# EAGLE design BlueCubeModR2 (EAGLE 9.3.0)

## Sheet 1 of 2
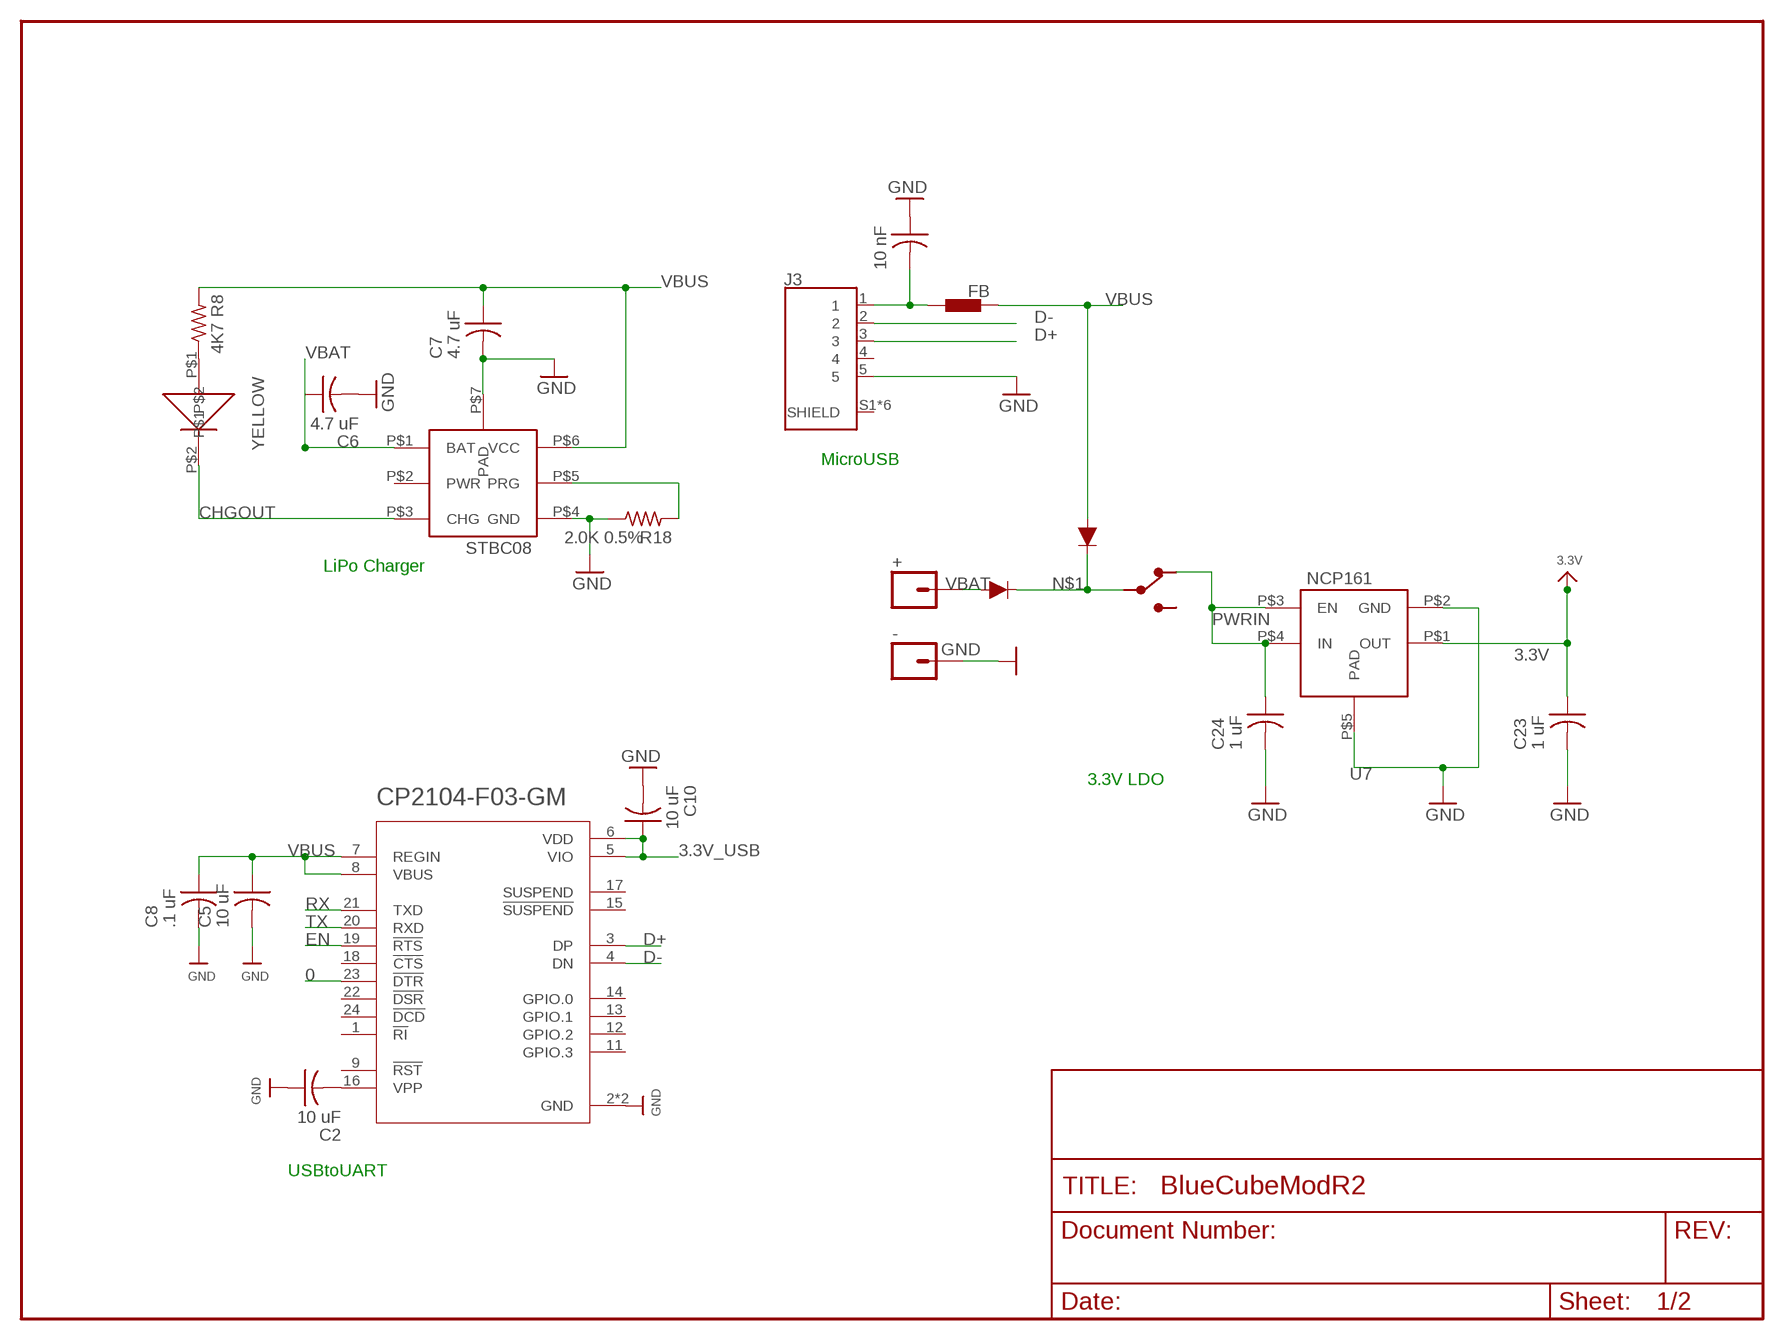
[diagram p0: schematic, sheet 1]

### Parts
+  CONN_01  [1X01]
-  CONN_01  [1X01]
C2  10 uF  C-US  [C0402_B]
C5  10 uF  C-US  [C0402_B]
C6  4.7 uF  C-US  [C0402_B]
C7  4.7 uF  C-US  [C0402_B]
C8  .1 uF  C-US  [C0402_B]
C10  10 uF  C-US  [C0402_B]
C11  10 nF  C-US  [C0402_B]
C23  1 uF  C-US  [C0402_B]
C24  1 uF  C-US  [C0402_B]
J3  2174507-2  [J_SMD_2174507-2-5_7.8_5_2.71]
L1  FB  BLM15H  [0402]
R8  4K7  R-US_  [R0402_B]
R18  2.0K 0.5%  R-US_  [R0402_B]
S2  JS102011JCQN  [SW_JS102011JCQN]
U2  CP2104-F03-GM  [QFN50P400X400X80-25N]
U4  STBC08  [STBC08]
U7  NCP161  [NCP161]
U$4  DIODD3  [DIODFN100X60X30-2]
U$5  DIODD3  [DIODFN100X60X30-2]
YELLOW  _  0402LED  [0402LED]

### Nets
0: U2.23(!DTR) ; also sheet 2
3.3V: C23.1 U7.P$1(OUT) ; also sheet 2
3.3V_USB: C10.1 U2.5(VIO) U2.6(VDD)
CHGOUT: U4.P$3(CHG) YELLOW.P$2
D+: J3.3 U2.3(DP)
D-: J3.2 U2.4(DN)
EN: U2.19(!RTS) ; also sheet 2
GND: -.1 C2.1 C5.2 C6.2 C7.2 C8.2 C10.2 C11.1 C23.2 C24.2 J3.5 R18.1 U2.2(GND) U2.25(GND) U4.P$4(GND) U4.P$7(PAD) U7.P$2(GND) U7.P$5(PAD) ; also sheet 2
N$1: S2.2 U$4.2(C) U$5.2(C)
N$3: R8.1 YELLOW.P$1
N$5: C11.2 J3.1 L1.2
N$6: C2.2 U2.16(VPP)
N$27: R18.2 U4.P$5(PRG)
PWRIN: C24.1 S2.1 U7.P$3(EN) U7.P$4(IN)
RX: U2.21(TXD) ; also sheet 2
TX: U2.20(RXD) ; also sheet 2
VBAT: +.1 C6.1 U4.P$1(BAT) U$4.1(A)
VBUS: C5.1 C7.1 C8.1 L1.1 R8.2 U2.7(REGIN) U2.8(VBUS) U4.P$6(VCC) U$5.1(A)
Unconnected: J3.4 J3.S1(SHIELD) J3.S2(SHIELD) J3.S3(SHIELD) J3.S4(SHIELD) J3.S5(SHIELD) J3.S6(SHIELD) S2.3 U2.1(!RI) U2.9(!RST!) U2.11(GPIO.3) U2.12(GPIO.2) U2.13(GPIO.1) U2.14(GPIO.0) U2.15(!SUSPEND!) U2.17(SUSPEND) U2.18(!CTS) U2.22(!DSR) U2.24(!DCD) U4.P$2(PWR)

### Notes on the sheet
- MicroUSB
- LiPo Charger
- 3.3V LDO
- USBtoUART

## Sheet 2 of 2
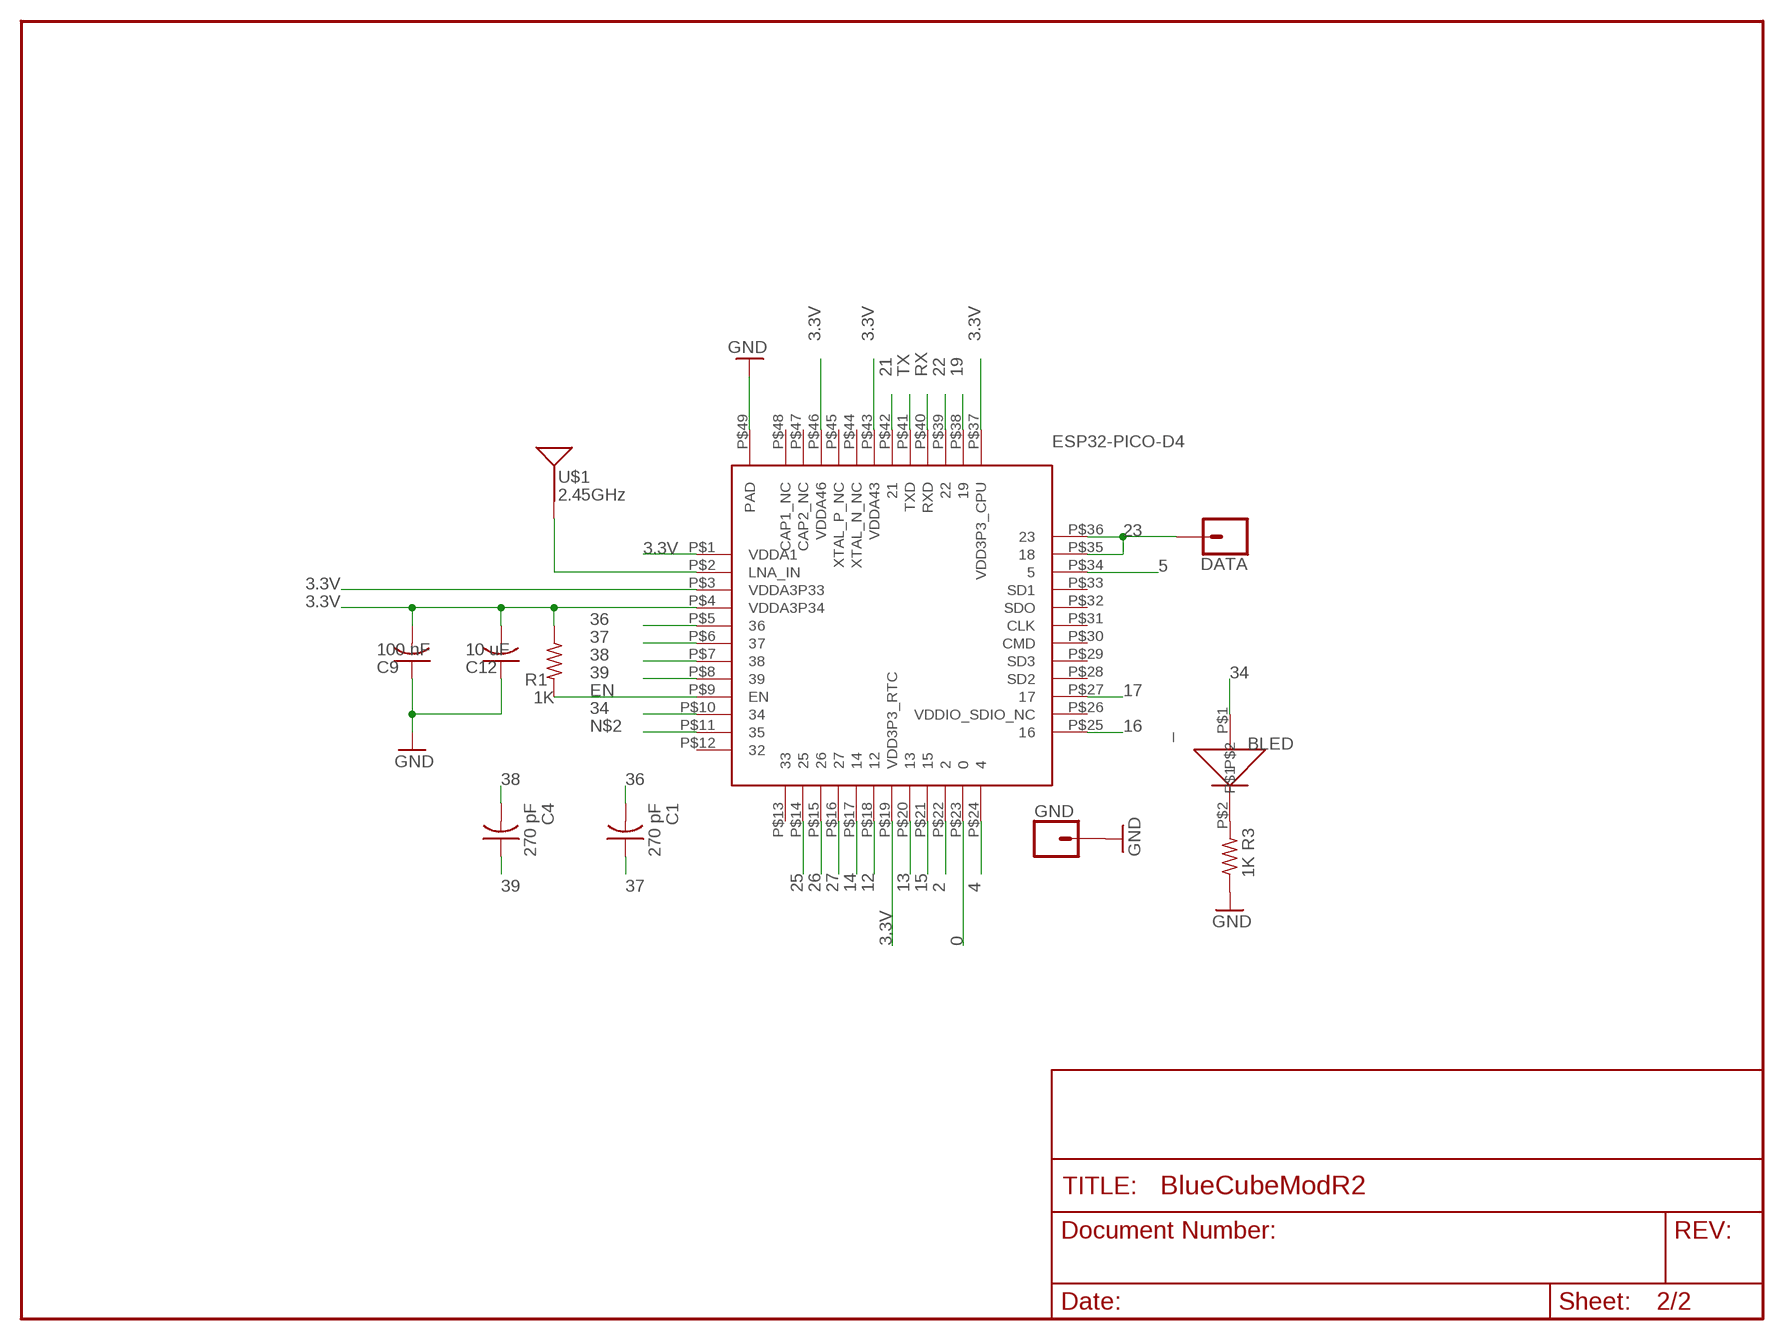
[diagram p1: schematic, sheet 2]

### Parts
BLED  _  0402LED  [0402LED]
C1  270 pF  C-US  [C0402_B]
C4  270 pF  C-US  [C0402_B]
C9  100 nF  C-US  [C0402_B]
C12  10 uF  C-US  [C0402_B]
DATA  CONN_01  [1X01]
GND  CONN_01  [1X01]
R1  1K  R-US_  [R0402_B]
R3  1K  R-US_  [R0402_B]
U1  ESP32-PICO-D4  [ESP32-PICO-D4]
U$1  2.45GHz  ANTENNA2.4GHZ-6.5X2.2MM  [ANT-2.4GHZ-6.5X2.2MM]

### Nets
0: U1.P$23 ; also sheet 1
2: U1.P$22
3.3V: C9.2 C12.2 R1.1 U1.P$1(VDDA1) U1.P$3(VDDA3P33) U1.P$4(VDDA3P34) U1.P$19(VDD3P3_RTC) U1.P$37(VDD3P3_CPU) U1.P$43(VDDA43) U1.P$46(VDDA46) ; also sheet 1
4: U1.P$24
5: U1.P$34
12: U1.P$18
13: U1.P$20
14: U1.P$17
15: U1.P$21
16: U1.P$25
17: U1.P$27
19: U1.P$38
21: U1.P$42
22: U1.P$39
23: DATA.1 U1.P$35 U1.P$36
25: U1.P$14
26: U1.P$15
27: U1.P$16
34: BLED.P$1 U1.P$10
36: C1.2 U1.P$5
37: C1.1 U1.P$6
38: C4.2 U1.P$7
39: C4.1 U1.P$8
EN: R1.2 U1.P$9(EN) ; also sheet 1
ESPANT: U1.P$2(LNA_IN) U$1.FEED(SIGNAL)
GND: C9.1 C12.1 GND.1 R3.1 U1.P$49(PAD) ; also sheet 1
N$2: U1.P$11
N$4: BLED.P$2 R3.2
RX: U1.P$40(RXD) ; also sheet 1
TX: U1.P$41(TXD) ; also sheet 1
Unconnected: U1.P$12 U1.P$13 U1.P$26(VDDIO_SDIO_NC) U1.P$28(SD2) U1.P$29(SD3) U1.P$30(CMD) U1.P$31(CLK) U1.P$32(SDO) U1.P$33(SD1) U1.P$44(XTAL_N_NC) U1.P$45(XTAL_P_NC) U1.P$47(CAP2_NC) U1.P$48(CAP1_NC)

## Library data of the parts
+ - DATA GND = SparkFun-Connectors:CONN_01: Single connection point. Often used as Generic Header-pin footprint for 0.1 inch spaced/style header connections On any of the 0.1 inch spaced packages, you can populate with these: Break Away Headers - Straight <https://www.sparkfun.com/products/116> (PRT-00116) Break Away Male Headers - Right Angle <https://www.sparkfun.com/products/553> (PRT-00553) Female Headers <https://www.sparkfun.com/products/115> (PRT-00115) Break Away Headers - Machine Pin <https://www.sparkfun.com/products/117> (PRT-00117) Break Away Female Headers - Swiss Machine Pin <https://www.sparkfun.com/products/743> (PRT-00743) This device is also useful as a general connection point to wire up your design to another part of your project. Our various solder wires solder well into these plated through hole pads. Hook-Up Wire - Assortment (Stranded, 22 AWG) <https://www.sparkfun.com/products/11375> (PRT-11375) Hook-Up Wire - Assortment (Solid Core, 22 AWG) <https://www.sparkfun.com/products/11367> (PRT-11367) View the entire wire category on our website here <https://www.sparkfun.com/categories/141> Special notes: SMTSO-256-ET is a "flush mount" nut for a 4-40 screw. We mostly use this on specialty testbeds; it is a nice way to connect hardware to your PCB at an adjustable hieght. Also note, the SNAP packages are for using a snappable style connector. We sell a baggie of snaps and they are also used on two LilyPad designs: Snap Assortment - 30 pack (male and female) <https://www.sparkfun.com/products/11347> (DEV-11347) LilyPad Arduino SimpleSnap <https://www.sparkfun.com/products/10941> (DEV-10941) LilyPad SimpleSnap Protoboard <https://www.sparkfun.com/products/10940> (DEV-10940)
BLED YELLOW = Kris:0402LED: 0402led
C1 C2 C4-C12 C23 C24 = Spark:C-US: Capacitor
J3 = 2174507-2:2174507-2: USB - micro B USB 2.0 Receptacle Connector 5 Position Surface Mount, Right Angle; CENTERLINE_PITCH: .65 mm[.025 in]; COMMENT: 2174507\-2; DESCRIPTION: REC TYPE-B ASSY MICRO USB I/O; DIGI-KEY_PART_NUMBER: A118106CT-ND; DIGI-KEY_PURCHASE_URL: https://www.digikey.com/product-detail/en/te-connectivity-amp-connectors/2174507-2/A118106CT-ND/4729913?utm_source=snapeda&utm_medium=aggregator&utm_campaign=symbol; EU_ROHS_COMPLIANCE: Compliant; LINK: http://www.te.com/usa-en/product-2174507-2.html; MF: TE Connectivity; MP: 2174507-2; NUMBER_OF_POSITIONS: 5; PACKAGE: None; PRODUCT_TYPE: Connector
L1 = STM32L433SARA.AssetTracker.v01:BLM15H: EMIFIL (R) Chip Ferrite Bead for GHz Noise Source: http://www.murata.com/ Ferrite Bead BLM15H.pdf
R1 R3 R8 R18 = Spark:R-US_: 0402 Resistor
S2 = JS102011JCQN:JS102011JCQN: Switch Slide Spdt 300ma 6v; AVAILABILITY: Unavailable; DESCRIPTION: Switch Slide Spdt 300ma 6v; MF: C&K; MP: JS102011JCQN; PACKAGE: None; PRICE: None
U1 = Kris:ESP32-PICO-D4: ESP32-PICO-D4 module https://www.espressif.com/sites/default/files/documentation/esp32-pico-d4_datasheet_en.pdf
U2 = CP2104:CP2104: Silabs CP2104 USB to UART Bridge; AVAILABILITY: Unavailable; DESCRIPTION: USB to UART Bridge; MF: Silicon Labs; MP: CP2104; PACKAGE: QFN-24 Silicon Labs; PRICE: None
U4 = Kris:STBC08: STBC08 800 mA standalone LiPo battery charger
U7 = Kris:NCP161: NCP161 3V3 LDO voltage regulator
U$1 = SparkFun-RF:ANTENNA: Single-ended Antennae 2.4GHz and antennae with just one terminal. These are all chip antennae. 2.4GHz (WiFi/BT/ZigBee) Antennae ANT-2.4GHZ-6.5X2.2MM - 6.5 x 2.2 mm chip antenna. (SparkFun Product <https://www.sparkfun.com/products/144>) ANT-2.4GHZ8.0X1.0MM - 8.0 x 1.0 mm chip antenna. (Datasheet <http://www.mouser.com/ds/2/611/antenna_2500at44m0400-242425.pdf>) ANT-2.4GHZ9.5X2.0MM - 9.5 x 2.0 mm chip antenna. (SparkFun Product <https://www.sparkfun.com/products/9025>); PROD_ID: ANT-08187; SF_ID: WRL-00144
U$4 U$5 = 0402:DIOD

## Board
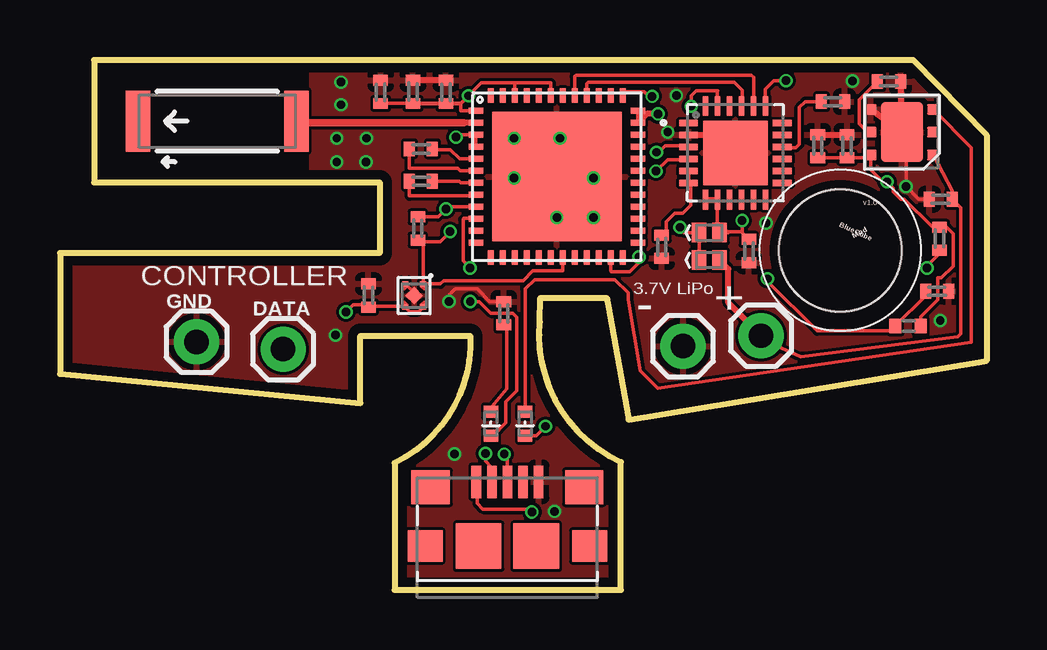
[diagram p2: board, top side]
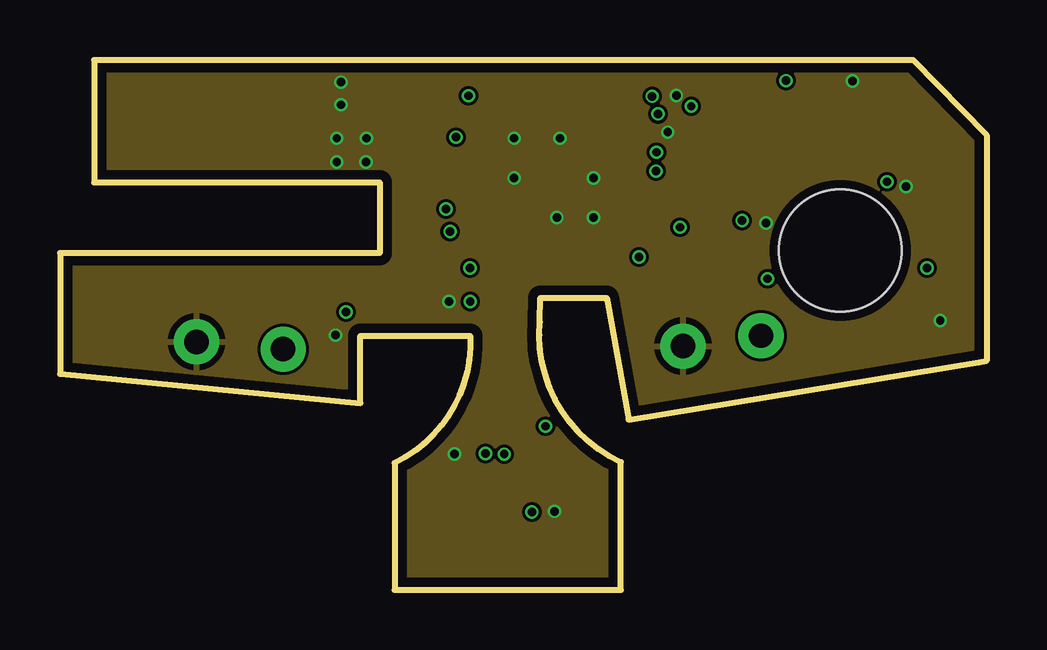
[diagram p3: board, inner layer Route2]
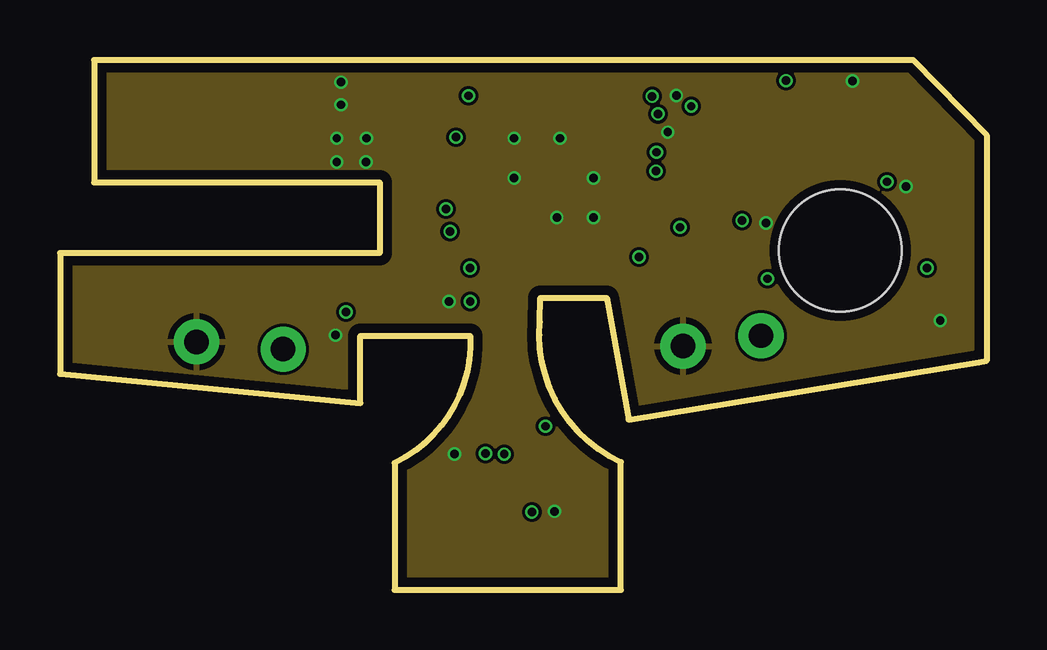
[diagram p4: board, inner layer Route15]
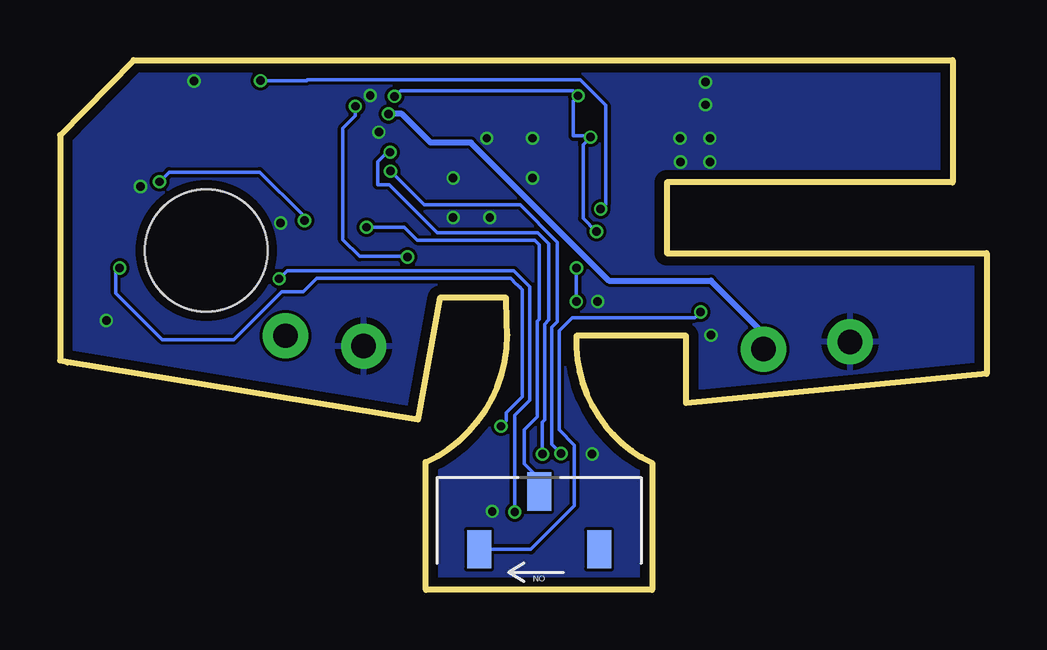
[diagram p5: board, bottom side, seen from below]

Size 38.61 x 22.08 mm. Coordinates in mm from the lower left corner, seen from the top.
Outline: 38.61,18.94 35.55,22.08 1.42,22.08 1.42,16.97 13.32,16.97 13.32,14.02 0,14.02 0,9 12.52,7.78 12.52,10.58 17.09,10.58 arc-67 13.94,5.29 13.94,0 23.37,0 23.37,5.31 arc-70 19.99,11.16 20.02,12.17 22.78,12.17 23.7,7.1 38.29,9.47 38.61,9.54 38.61,18.94
Copper layers (1*2*15*16): Top 0.035559375mm / dielectric 0.17018125mm / Route2 0.01778125mm / dielectric 47mil / Route15 0.01778125mm / dielectric 0.17018125mm / Bottom 0.035559375mm
Design rules "oshpark-4layer": minimum track width 5mil, minimum drill 10mil, track to track 5mil, track to pad 5mil, pad to pad 5mil, via to via 5mil, smd to smd 5mil, copper to edge 15mil, drill to drill 6mil, minimum pad ring 4mil, minimum via ring 4mil, stop-mask expansion 2.5mil, vias tented up to drill 0mil, thermal gap 10mil
Holes 5.1 mm at 32.51,14.14

### Footprints (pad centres in the part's own frame; a part is rotated, then mirrored left to right if it is on the bottom)
1X01 = drill 1.016 pad 1.88: 1 0,0
0402LED = smd 0.5 x 0.6: P$1 -0.5,0; P$2 0.5,0
C0402_B = smd 0.457 x 0.61: 1 -0.483,0; 2 0.483,0
J_SMD_2174507-2-5_7.8_5_2.71 = smd 0.4 x 1.35: 1 -1.3,2.675; 2 -0.65,2.675; 3 0,2.675; 4 0.65,2.675; 5 1.3,2.675 | smd 1.6 x 1.4: S1 -3.2,2.45; S6 3.2,2.45 | smd 1.45 x 1.3: S2 -3.425,0; S5 3.425,0 | smd 1.9 x 1.9: S3 -1.2,0; S4 1.2,0
0402 = smd 0.5 x 0.61: 1 -0.5,0; 2 0.55,0
R0402_B = smd 0.457 x 0.61: 1 -0.483,0; 2 0.483,0
SW_JS102011JCQN = smd 1 x 1.6: 1 -2.5,-1.2; 2 0,1.2; 3 2.5,-1.2
ESP32-PICO-D4 = smd 0.6 x 0.25: P$1 -3.375,2.75; P$2 -3.375,2.25; P$3 -3.375,1.75; P$4 -3.375,1.25; P$5 -3.375,0.75; P$6 -3.375,0.25; P$7 -3.375,-0.25; P$8 -3.375,-0.75; P$9 -3.375,-1.25; P$10 -3.375,-1.75; P$11 -3.375,-2.25; P$12 -3.375,-2.75; P$25 3.375,-2.75; P$26 3.375,-2.25; P$27 3.375,-1.75; P$28 3.375,-1.25; P$29 3.375,-0.75; P$30 3.375,-0.25; P$31 3.375,0.25; P$32 3.375,0.75; P$33 3.375,1.25; P$34 3.375,1.75; P$35 3.375,2.25; P$36 3.375,2.75 | smd 0.25 x 0.6: P$13 -2.75,-3.375; P$14 -2.25,-3.375; P$15 -1.75,-3.375; P$16 -1.25,-3.375; P$17 -0.75,-3.375; P$18 -0.25,-3.375; P$19 0.25,-3.375; P$20 0.75,-3.375; P$21 1.25,-3.375; P$22 1.75,-3.375; P$23 2.25,-3.375; P$24 2.75,-3.375; P$37 2.75,3.375; P$38 2.25,3.375; P$39 1.75,3.375; P$40 1.25,3.375; P$41 0.75,3.375; P$42 0.25,3.375; P$43 -0.25,3.375; P$44 -0.75,3.375; P$45 -1.25,3.375; P$46 -1.75,3.375; P$47 -2.25,3.375; P$48 -2.75,3.375 | smd 5.4 x 5.4: P$49 0,0
QFN50P400X400X80-25N = smd 0.81 x 0.26: 1 -1.955,1.25; 2 -1.955,0.75; 3 -1.955,0.25; 4 -1.955,-0.25; 5 -1.955,-0.75; 6 -1.955,-1.25; 13 1.955,-1.25; 14 1.955,-0.75; 15 1.955,-0.25; 16 1.955,0.25; 17 1.955,0.75; 18 1.955,1.25 | smd 0.26 x 0.81: 7 -1.25,-1.955; 8 -0.75,-1.955; 9 -0.25,-1.955; 10 0.25,-1.955; 11 0.75,-1.955; 12 1.25,-1.955; 19 1.25,1.955; 20 0.75,1.955; 21 0.25,1.955; 22 -0.25,1.955; 23 -0.75,1.955; 24 -1.25,1.955 | smd 2.68 x 2.68: 25 0,0
STBC08 = smd 0.45 x 0.5: P$1 -0.95,-1.3; P$2 0,-1.3; P$3 0.95,-1.3; P$4 0.95,1.3; P$5 0,1.3; P$6 -0.95,1.3 | smd 2.5 x 1.75: P$7 0,0
NCP161 = smd 0.24 x 0.24: P$1 -0.37,-0.48; P$2 0.37,-0.48; P$3 0.37,0.48; P$4 -0.37,0.48 | smd 0.52 x 0.52 rotated 45: P$5 0,0
ANT-2.4GHZ-6.5X2.2MM = smd 1.016 x 2.54: FEED -3.302,0; NC 3.302,0
DIODFN100X60X30-2 = smd 0.612 x 0.812: 1 -0.425,0; 2 0.425,0

### Placement (x,y rotation side)
+  29.21,10.59 0 top
-  25.96,10.15 0 top
BLED  17.96,6.93 90 top
C1  15.04,18.37 0 top
C2  32.21,20.34 180 top
C4  15.04,17.02 0 top
C5  31.57,18.49 90 top
C6  36.7,16.28 180 top
C7  32.79,18.49 90 top
C8  28.7,14.12 270 top
C9  16.08,20.75 270 top
C10  25.07,14.29 270 top
C11  36.55,12.44 180 top
C12  13.36,20.75 270 top
C23  14.71,20.75 90 top
C24  12.85,12.26 90 top
DATA  9.3,10.03 0 top
GND  5.69,10.33 0 top
J3  18.64,1.82 0 top
L1  35.36,10.99 180 top
R1  14.91,15.06 90 top
R3  18.49,11.53 270 top
R8  36.65,14.62 90 top
R18  34.54,21.18 180 top
S2  18.64,2.89 0 bottom
U1  20.7,17.22 0 top
U2  28.14,18.21 0 top
U4  35.08,19.07 90 top
U7  14.76,12.26 180 top
U$1  6.55,19.53 180 top
U$4  27.05,13.74 180 top
U$5  27.05,14.88 180 top
YELLOW  19.38,6.93 90 top

### Tracks (layer width: path | path; a pad name or v marks a point on that pad's centre or on a via)
0  (via drill 0.35)
  Top 0.152: U1.P$23 22.94,13.29 22.98,13.26 23.75,13.26 24.13,13.64 v24.13,13.86 | v26.3,20.15 26.3,20.58 26.52,20.79 27.4,20.79 27.39,20.78 U2.23
  Bottom 0.152: v26.3,20.15 26.3,19.75 26.82,19.24 26.82,14.58 26.13,13.89 24.16,13.89 v24.13,13.86
3.3V  (via drill 0.35)
  Top 0.152: U1.P$4 U1.P$3 16.6,18.96 v16.5,18.86 | U1.P$19 20.96,13.29 19.7,13.29 19.3,12.88 15.98,12.88 15.85,12.74 U7.P$1 15.13,14.51 | U1.P$37 23.6,20.74 24.34,20.74 24.52,20.56 v24.67,20.56 | 18.94,21.12 U1.P$46 | U1.P$43 20.46,21.12 18.94,21.12 | U1.P$1 16.69,19.97 16.69,20.25 v17.02,20.59 | C23.1 16.7,20.26 v17.02,20.59 | v17.02,20.59 16.69,20.26 C9.2 C23.1 | v17.02,20.59 17.55,21.12 18.94,21.12 | C12.2 C23.1 | C23.1 | v16.26,14.93 15.84,14.51 15.13,14.51 | 15.13,14.51 14.91,14.51 R1.1
  Bottom 0.152: v16.26,14.93 16.81,15.48 16.81,18.55 v16.5,18.86 16.55,18.91 17.22,18.91 17.22,20.38 v17.02,20.59 17.22,20.79 24.42,20.79 24.64,20.56 v24.67,20.56
3.3V_USB
  Top 0.152: U2.5 U2.6 26.29,16.86 26.29,16.02 25.96,15.69 25.61,15.69 25.25,15.33 25.25,14.96 C10.1
23  (via drill 0.35)
  Top 0.152: U1.P$36 U1.P$35
  Top 0.254: v24.92,19.83 24.44,19.83 U1.P$35
  Bottom 0.254: v24.92,19.83 24.36,19.83 23.16,18.64 21.49,18.64 15.73,12.88 11.49,12.88 9.3,10.69 DATA.1
34  (via drill 0.35)
  Top 0.152: U1.P$10 16.83,15.47 16.8,15.44 16.8,13.7 v17.09,13.41 | v17.09,12.01 17.47,12.01 17.96,11.53 18.86,11.53 19.02,11.37 19.02,8.29 18.57,7.83 18.57,6.95 18.04,6.43 BLED.P$1
  Bottom 0.152: v17.09,13.41 v17.09,12.02 v17.09,12.01
36
  Top 0.152: U1.P$5 16.65,17.96 16.26,18.35 15.54,18.35 C1.2
37
  Top 0.152: U1.P$6 16.68,17.46 16.58,17.56 14.55,17.56 C1.1
38
  Top 0.152: U1.P$7 17.31,16.97 17.31,16.96 16.7,16.96 16.64,17.02 C4.2
39
  Top 0.152: C4.1 14.55,16.41 17.27,16.41 U1.P$8
CHGOUT
  Top 0.152: YELLOW.P$2 19.38,12.54 19.78,12.93 23.12,12.93 23.67,12.38 23.67,12.08 24.17,9.13 24.9,8.39 37.97,10.31 37.97,18.42 U4.P$3
D+  (via drill 0.35)
  Top 0.152: J3.3 18.64,5.52 v18.51,5.65 | v24.85,18.23 24.95,18.23 25.22,18.5 26.15,18.5 U2.3
  Bottom 0.152: v18.51,5.65 18.51,6.99 18.42,7.08 18.42,11.07 18.24,11.25 18.24,14.41 18.71,14.88 22.88,14.88 24.88,16.88 25.38,16.88 25.38,17.84 24.98,18.23 v24.85,18.23
D-  (via drill 0.35)
  Top 0.152: J3.2 17.97,4.52 17.97,5.11 17.73,5.36 v17.73,5.68 | v24.83,17.44 25.31,17.93 26.16,17.93 U2.4
  Bottom 0.152: v17.73,5.68 18.11,6.07 18.11,10.94 17.88,11.17 17.88,14.49 19.44,16.04 23.43,16.04 v24.83,17.44
EN  (via drill 0.35)
  Top 0.152: v30.25,21.21 29.74,21.21 29.39,20.86 U2.19 | U1.P$9 16.18,15.97 v16.08,15.86 15.76,15.54 R1.2
  Bottom 0.152: v16.08,15.86 15.87,16.07 15.87,20.19 16.94,21.25 28.3,21.25 28.34,21.21 v30.25,21.21
ESPANT
  Top 0.254: U1.P$2 16.82,19.47 16.81,19.46
  Top 0.305: U$1.FEED 9.92,19.47 16.82,19.47
GND  (via drill 0.35)
  Top 0.152: U7.P$2 14.76,12.37 U7.P$5 | U4.P$4 35.05,19.09 | 35.06,18.85 35.1,18.81 34.98,18.94 U4.P$7 35.25,18.89 v35.25,16.81 35.79,16.28 C6.2 | R3.1 17.91,12.01 17.38,12.54 16.47,12.54 16.21,12.28 v16.21,12.01 v16.2,12.01
  Top 0.254: R18.1 35.05,19.09 35.06,18.85 | U4.P$4 U4.P$7 | U2.2 27.39,18.96 U2.25 | C5.2 | C5.2 C7.2 | C9.1 C23.2
  other vias: 20.6,3.27 18.92,18.82 18.92,17.16 20.83,18.82 22.22,17.16 22.22,15.51 20.7,15.51 36.68,11.22 33.02,21.2 16.43,5.66 11.48,10.61 25.68,20.59 25.32,19.07 11.71,21.15 11.53,18.82 29.41,15.28 12.78,18.82 12.75,17.82 11.53,17.82 11.71,20.21
  pour Top: -0.23,14.19 -0.23,-0.21 38.96,-0.21 38.96,22.37 10.44,22.37 10.44,14.19
  pour Bottom: 1.16,22.31 1.16,14.24 -0.23,14.24 -0.23,-0.21 38.96,-0.21 38.96,22.31
  pour Route2: 1.16,22.3 1.16,14.27 -0.18,14.27 -0.18,-0.36 38.76,-0.36 38.76,22.3
  pour Route15: 1.17,22.32 1.17,14.24 -0.23,14.24 -0.23,-0.36 38.79,-0.36 38.79,22.32
N$1  (via drill 0.35)
  Top 0.152: v25.83,15.11 25.98,14.95 25.98,14.88 26.45,14.88 | 26.45,14.88 U$5.2 | U$4.2 26.63,14.7 26.45,14.88
  Bottom 0.152: v25.83,15.11 24.26,15.11 23.72,14.57 18.83,14.57 18.64,14.39 18.64,11.27 18.72,11.19 18.72,7.2 19.26,6.67 19.26,5.25 18.64,4.63 S2.2
N$3  (via drill 0.35)
  Top 0.152: v20.23,6.82 19.85,6.43 YELLOW.P$1 | v36.12,13.41 36.12,13.48 36.65,14.01 R8.1
  Bottom 0.152: v20.23,6.82 20,7.04 20,7.37 19.34,8.03 19.34,12.5 19.44,12.59 19.44,12.6 19.61,12.76 19.83,12.99 27.91,12.99 28.48,12.42 29.37,12.42 31.37,10.43 34.34,10.43 36.28,12.36 36.28,13.25 v36.12,13.41
N$4
  Top 0.152: R3.2 18.62,10.92 18.62,8.37 17.88,7.51 BLED.P$2
N$5  (via drill 0.35)
  Top 0.152: J3.1 17.39,4.45 17.39,3.6 17.62,3.37 19.54,3.37 v19.66,3.25 | v29.48,12.96 29.48,12.85 31.55,10.78 34.6,10.78 L1.2 36.07,12.25 C11.2
  Bottom 0.152: v19.66,3.25 19.66,7.27 19.03,7.91 19.03,12.62 19.7,13.29 29.14,13.29 v29.48,12.96
N$6
  Top 0.152: U2.16 30.13,18.42 30.67,18.42 30.81,18.56 30.81,20.11 31.04,20.34 C2.2
N$27
  Top 0.152: R18.2 | U4.P$5 33.65,19.07 33.3,19.42 33.3,20.41 R18.2
PWRIN  (via drill 0.35)
  Top 0.152: U7.P$4 14.94,11.59 14.58,11.59 U7.P$3 14.36,11.81 12.88,11.81 C24.1 12.75,11.88 12.22,11.88 v11.91,11.58
  Bottom 0.152: v11.91,11.58 12.15,11.34 17.26,11.34 17.8,10.8 17.8,6.66 17.17,6.03 17.17,3.51 18.99,1.69 S2.1
RX
  Top 0.152: U1.P$40 21.94,21.09 22,21.14 28.1,21.14 28.42,20.82 28.42,20.19 U2.21
TX
  Top 0.152: U1.P$41 21.44,21.39 21.5,21.45 28.81,21.45 28.9,21.36 U2.20
VBAT
  Top 0.152: U4.P$1 37.19,16.62 C6.1 37.54,15.92 37.54,10.67 37.41,10.54 30.87,9.71 29.46,10.33 +.1
  Top 0.254: +.1 27.84,11.95 27.84,13.37 U$4.1
VBUS  (via drill 0.35)
  Top 0.152: L1.1 35.86,11.37 36.58,12.09 36.58,13 36.72,13 37.21,13.49 37.21,14.85 36.95,15.11 R8.2 36.62,15.14 36.32,15.14 35.19,16.28 35.03,16.28 34.73,16.59 34.73,16.74 v34.46,17 34.28,17 33.78,17.51 U4.P$6 33.69,18.12 33.52,18.01 33.54,18 C7.1 C5.1 | v28.42,15.39 28.42,14.88 C8.1 28.38,14.92 27.8,14.92 | C5.1 | 27.8,14.92 27.84,14.88 U$5.1 | 27.8,14.92 27.39,15.32 U2.8
  Top 0.254: U2.7 U2.8
  Bottom 0.152: v28.42,15.39 28.52,15.49 28.52,15.64 30.29,17.41 34.06,17.41 v34.46,17

### Text on the board
tPlace: v1.0 | BlueCube | Mod | 3.7V LiPo
tNames: CONTROLLER | - | +